# Altium schematic sheet PWR RAIL.SchDoc: C-F-U-Bridge
size A3; ApprovedBy: Luca Schenetti; CheckedBy: Luca Schenetti; Author: Luca Schenetti; DrawnBy: Luca Schenetti; Engineer: Luca Schenetti; Revision: A; SheetNumber: 2; SheetTotal: 7
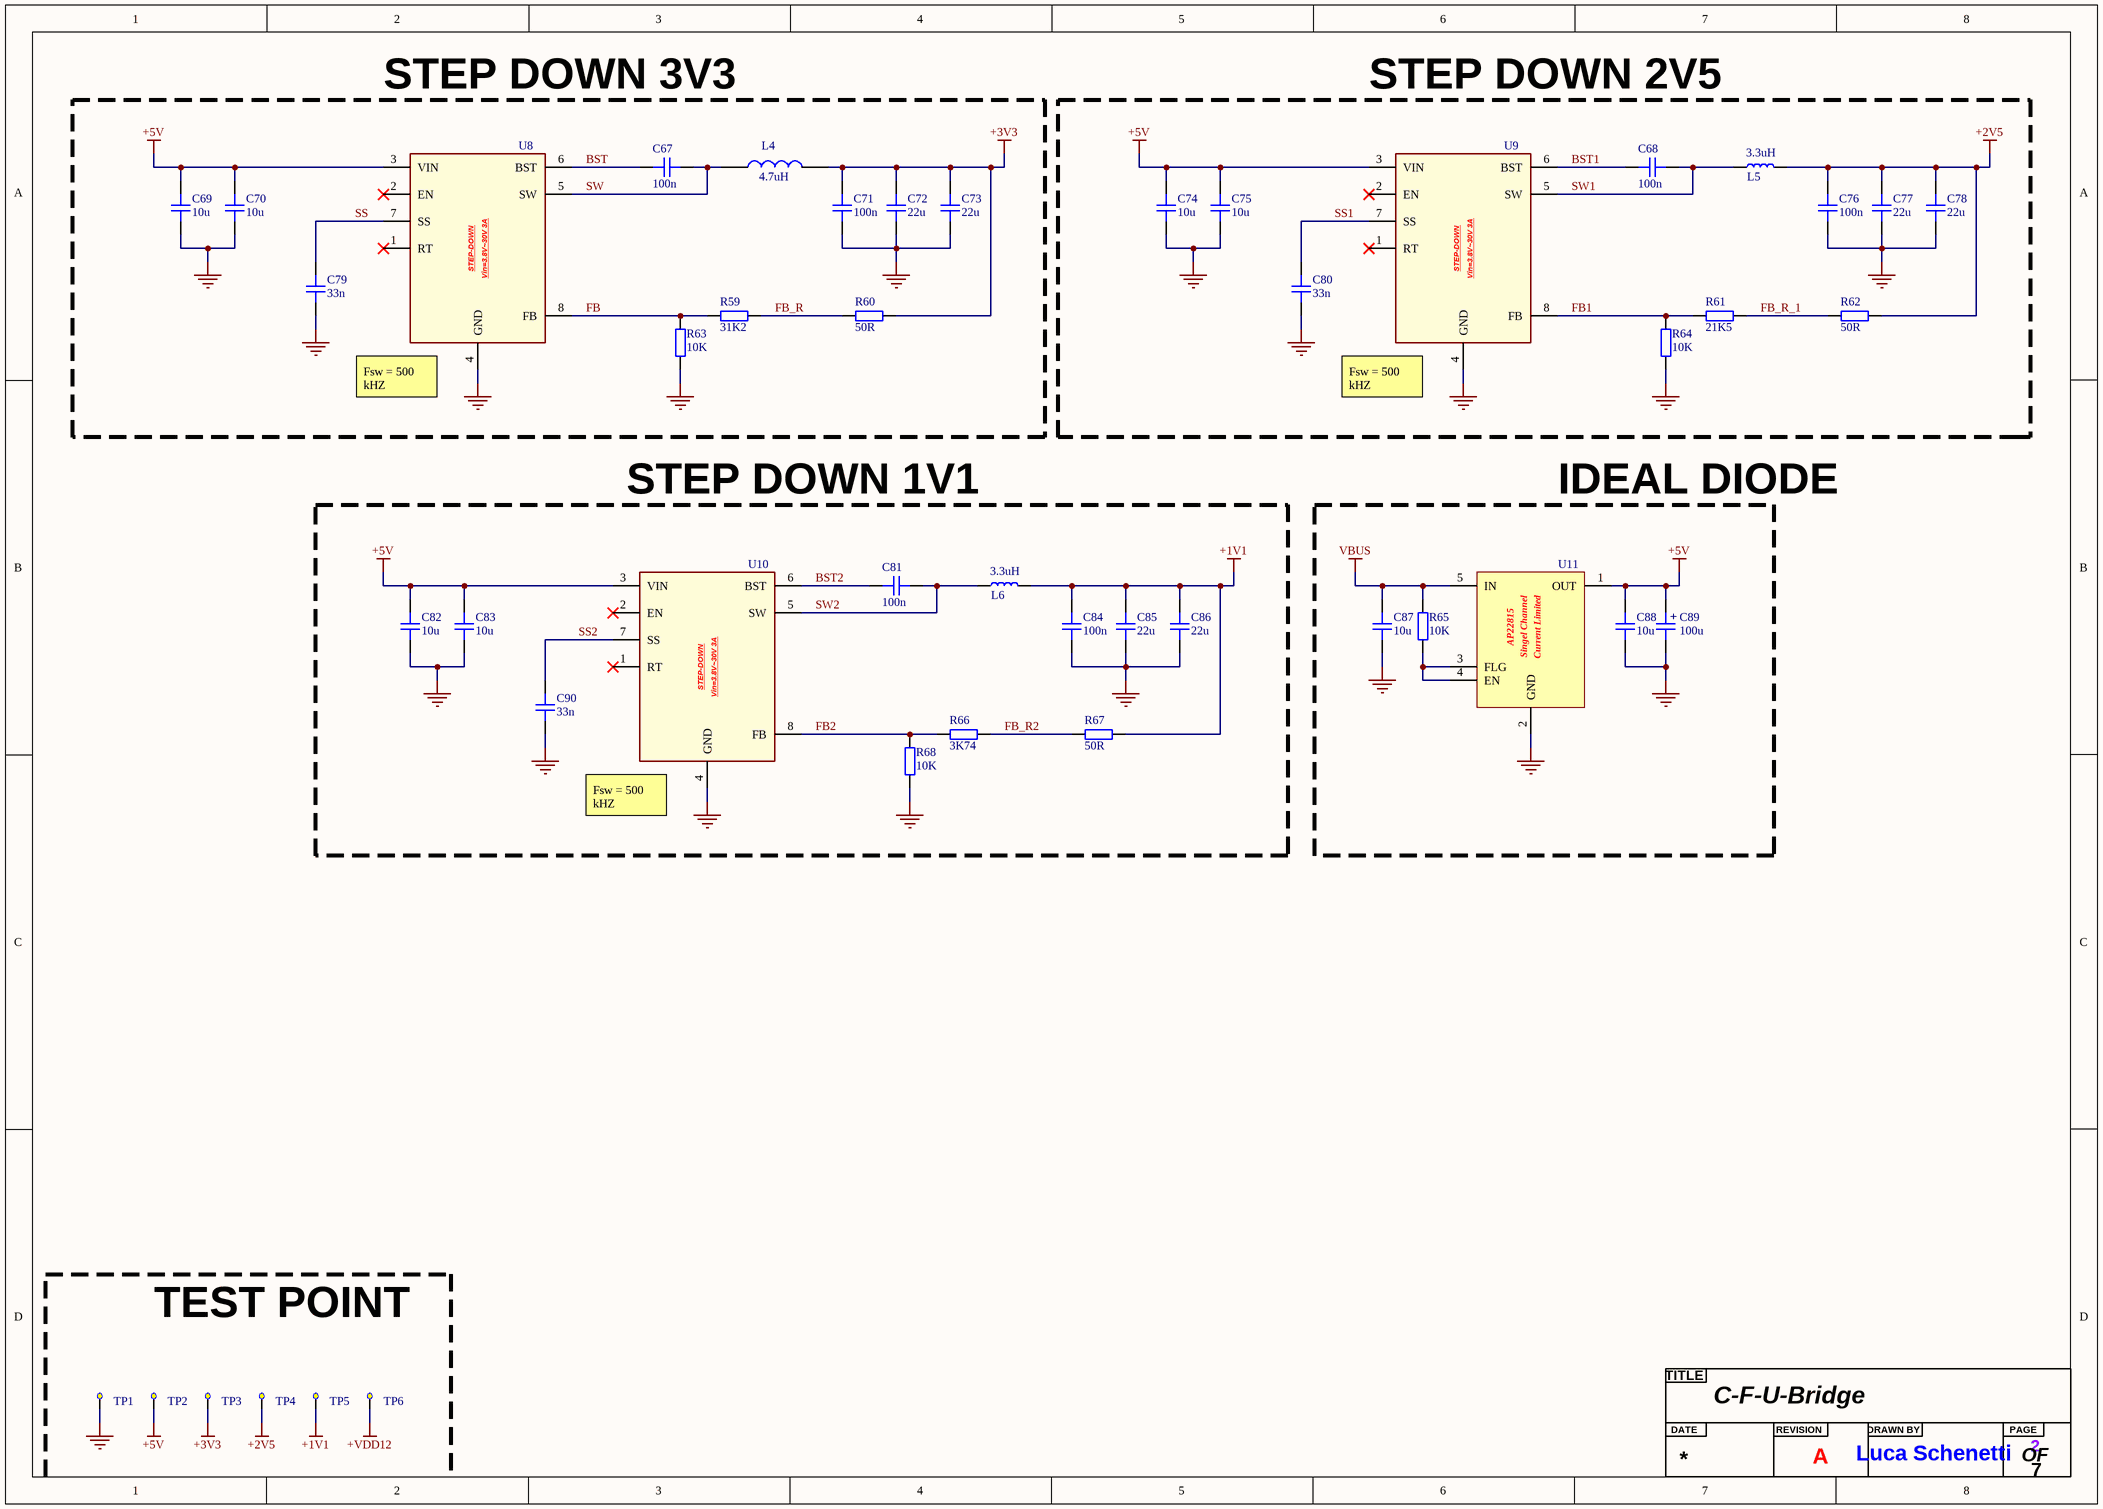
[diagram p0: PWR RAIL.SchDoc]

## Parts
?  Title  (value not drawn)  (graphical)
C67  100n  [CAP_0603]
C68  100n  [CAP_0603]
C69  10u  [CAP_0805]
C70  10u  [CAP_0805]
C71  100n  [CAP_0603]
C72  22u  [CAP_0603]
C73  22u  [CAP_0603]
C74  10u  [CAP_0805]
C75  10u  [CAP_0805]
C76  100n  [CAP_0603]
C77  22u  [CAP_0603]
C78  22u  [CAP_0603]
C79  33n  [CAP_0603]
C80  33n  [CAP_0603]
C81  100n  [CAP_0603]
C82  10u  [CAP_0805]
C83  10u  [CAP_0805]
C84  100n  [CAP_0603]
C85  22u  [CAP_0603]
C86  22u  [CAP_0603]
C87  10u  [CAP_0603]
C88  10u  [CAP_0603]
C89  100u  [CAP_AE_SMD_D6MM3_H5M55]
C90  33n  [CAP_0603]
L4  4.7uH  [FXL0530-4R7-M]
L5  3.3uH  [FXL0420-3R3-M]
L6  3.3uH  [FXL0420-3R3-M]
R59  31K2  [RES_0603]
R60  50R  [RES_0603]
R61  21K5  [RES_0603]
R62  50R  [RES_0603]
R63  10K  [RES_0603]
R64  10K  [RES_0603]
R65  10K  [RES_0603]
R66  3K74  [RES_0603]
R67  50R  [RES_0603]
R68  10K  [RES_0603]
TP1  Test Point  [Test Point]  (value not drawn)  (no BOM)
TP2  Test Point  [Test Point]  (value not drawn)  (no BOM)
TP3  Test Point  [Test Point]  (value not drawn)  (no BOM)
TP4  Test Point  [Test Point]  (value not drawn)  (no BOM)
TP5  Test Point  [Test Point]  (value not drawn)  (no BOM)
TP6  Test Point  [Test Point]  (value not drawn)  (no BOM)
U8  Step Down Converter 3A 3.8V~30V  [TPS62933DRLR]  (value not drawn)
U9  Step Down Converter 3A 3.8V~30V  [TPS62933DRLR]  (value not drawn)
U10  Step Down Converter 3A 3.8V~30V  [TPS62933DRLR]  (value not drawn)
U11  Single-Channel, Current-Limited  [AP22815]  (value not drawn)

## Blocks framed on the sheet
STEP DOWN 3V3: C67 C69-C73 C79 L4 R59 R60 R63 U8
STEP DOWN 2V5: C68 C74-C78 C80 L5 R61 R62 R64 U9
IDEAL DIODE: C87-C89 R65 U11

## Nets
+1V1: C84.1 C85.2 C86.2 L6.2 R67.1 TP5.1(Test_Point)
+2V5: C76.1 C77.2 C78.2 L5.2 R62.1 TP4.1(Test_Point)
+3V3: C71.1 C72.2 C73.2 L4.2 R60.1 TP3.1(Test_Point)
+5V: C69.2 C70.2 C74.2 C75.2 C82.2 C83.2 C88.2 C89.1 TP2.1(Test_Point) U8.3(VIN) U9.3(VIN) U10.3(VIN) U11.1(OUT)
+VDD12: TP6.1(Test_Point)
GND: C69.1 C70.1 C71.2 C72.1 C73.1 C74.1 C75.1 C76.2 C77.1 C78.1 C79.2 C80.2 C82.1 C83.1 C84.2 C85.1 C86.1 C87.1 C88.1 C89.2 C90.2 R63.1 R64.1 R68.1 TP1.1(Test_Point) U8.4(GND) U9.4(GND) U10.4(GND) U11.2(GND)
VBUS: C87.2 R65.2 U11.5(IN)
BST: C67.2 U8.6(BST)
BST1: C68.2 U9.6(BST)
BST2: C81.2 U10.6(BST)
FB: R59.2 R63.2 U8.8(FB)
FB1: R61.2 R64.2 U9.8(FB)
FB2: R66.2 R68.2 U10.8(FB)
FB_R: R59.1 R60.2
FB_R2: R66.1 R67.2
FB_R_1: R61.1 R62.2
SS: C79.1 U8.7(SS)
SS1: C80.1 U9.7(SS)
SS2: C90.1 U10.7(SS)
SW: C67.1 L4.1 U8.5(SW)
SW1: C68.1 L5.1 U9.5(SW)
SW2: C81.1 L6.1 U10.5(SW)
NetR65_1: R65.1 U11.3(FLG) U11.4(EN)

Not connected (* = marked no-connect by the designer): U8 1(RT)* 2(EN)*; U9 1(RT)* 2(EN)*; U10 1(RT)* 2(EN)*

## Notes on the sheet
- (near U8) Fsw = 500 kHZ
- (near U9) Fsw = 500 kHZ
- STEP DOWN 1V1
- (near U10) Fsw = 500 kHZ
- TEST POINT
- (in symbol AP22815AWT-7) AP22815; Singel Channel; Current Limited
- (in symbol CAP_ALEL_6.3x5.5) +
- (in symbol Title) TITLE; DATE; REVISION; DRAWN BY; PAGE; OF
- (in symbol TPS62933DRLR) STEP-DOWN; Vin=3.8V~30V 3A

## Library data of the parts
C67 C68 C71 C76 C81 C84 = CAP_0603: Capacitor SMD 0603 [C14663]; Manufacturer: *; Manufacturer Part Number: *; Distributor Link: *; LCSC: *; Rating: *; Dielectric: *
C69 C70 C74 C75 C82 C83 = CAP_0805: Capacitor SMD 0805[C440198]; Manufacturer: *; Manufacturer Part Number: *; Distributor Link: *; LCSC: *; Rating: *; Dielectric: *
C72 C73 C77 C78 C85 C86 = CAP_0603: Capacitor SMD 0603 [C59461]; Manufacturer: *; Manufacturer Part Number: *; Distributor Link: *; LCSC: *; Rating: *; Dielectric: *
C79 C80 C90 = CAP_0603: [C21117]; Manufacturer: *; Manufacturer Part Number: *; Distributor Link: *; LCSC: *; Rating: *; Dielectric: *
C87 C88 = CAP_0603: [C96446]; Manufacturer: *; Manufacturer Part Number: *; Distributor Link: *; LCSC: *; Rating: *; Dielectric: *
C89 = CAP_ALEL_6.3x5.5: [C59936]; Manufacturer: *; Manufacturer Part Number: *; Distributor Link: *; LCSC: *
L4 = FXL0530-4R7-M: [C177246]
L5 L6 = FXL0420-3R3-M: [C167207]
R59 = RES_0603: [C863036]; Manufacturer: *; Manufacturer Part Number: *; Distributor Link: *; LCSC: *
R60 R62 R67 = RES_0603: [C849792]; Manufacturer: *; Manufacturer Part Number: *; Distributor Link: *; LCSC: *
R61 = RES_0603: [C22911]; Manufacturer: *; Manufacturer Part Number: *; Distributor Link: *; LCSC: *
R63-R65 R68 = RES_0603: [C25804]; Manufacturer: *; Manufacturer Part Number: *; Distributor Link: *; LCSC: *
R66 = RES_0603: [C23016]; Manufacturer: *; Manufacturer Part Number: *; Distributor Link: *; LCSC: *
U8-U10 = TPS62933DRLR: [C3200405]
U11 = AP22815AWT-7: [C2150007]
TP1-TP6 = Test Point: Value: Test Point